# EAGLE schematic gd32 (EAGLE 9.6.2)

## Sheet 1 of 3
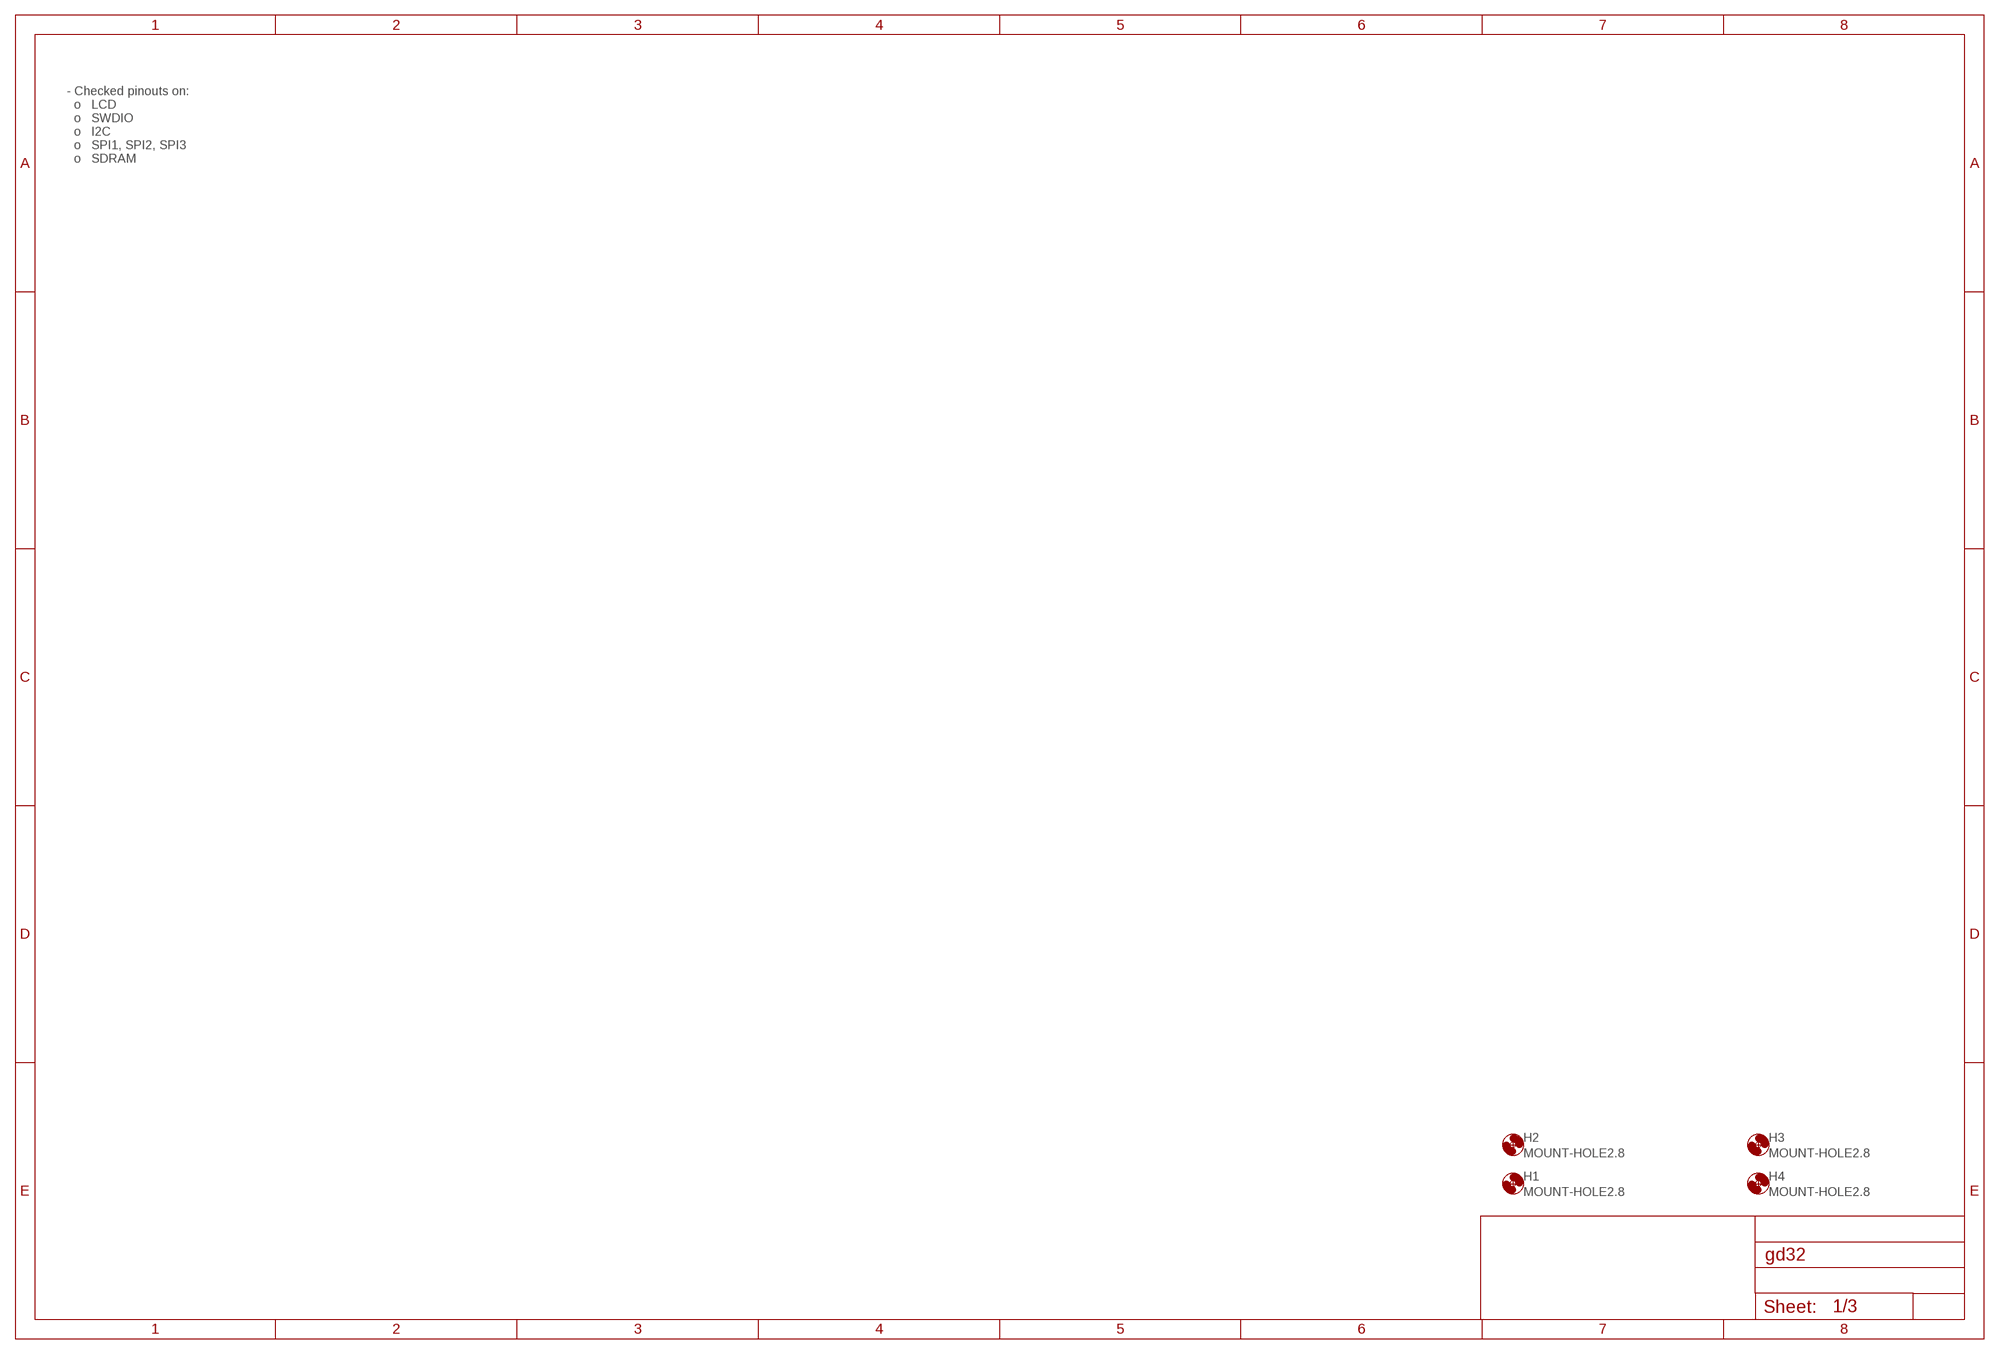
[diagram p0: schematic, sheet 1]

### Parts
H1  MOUNT-HOLE2.8  [2,8]
H2  MOUNT-HOLE2.8  [2,8]
H3  MOUNT-HOLE2.8  [2,8]
H4  MOUNT-HOLE2.8  [2,8]

### Notes on the sheet
- - Checked pinouts on:
    o   LCD
    o   SWDIO
    o   I2C
    o   SPI1, SPI2, SPI3
    o   SDRAM

## Sheet 2 of 3
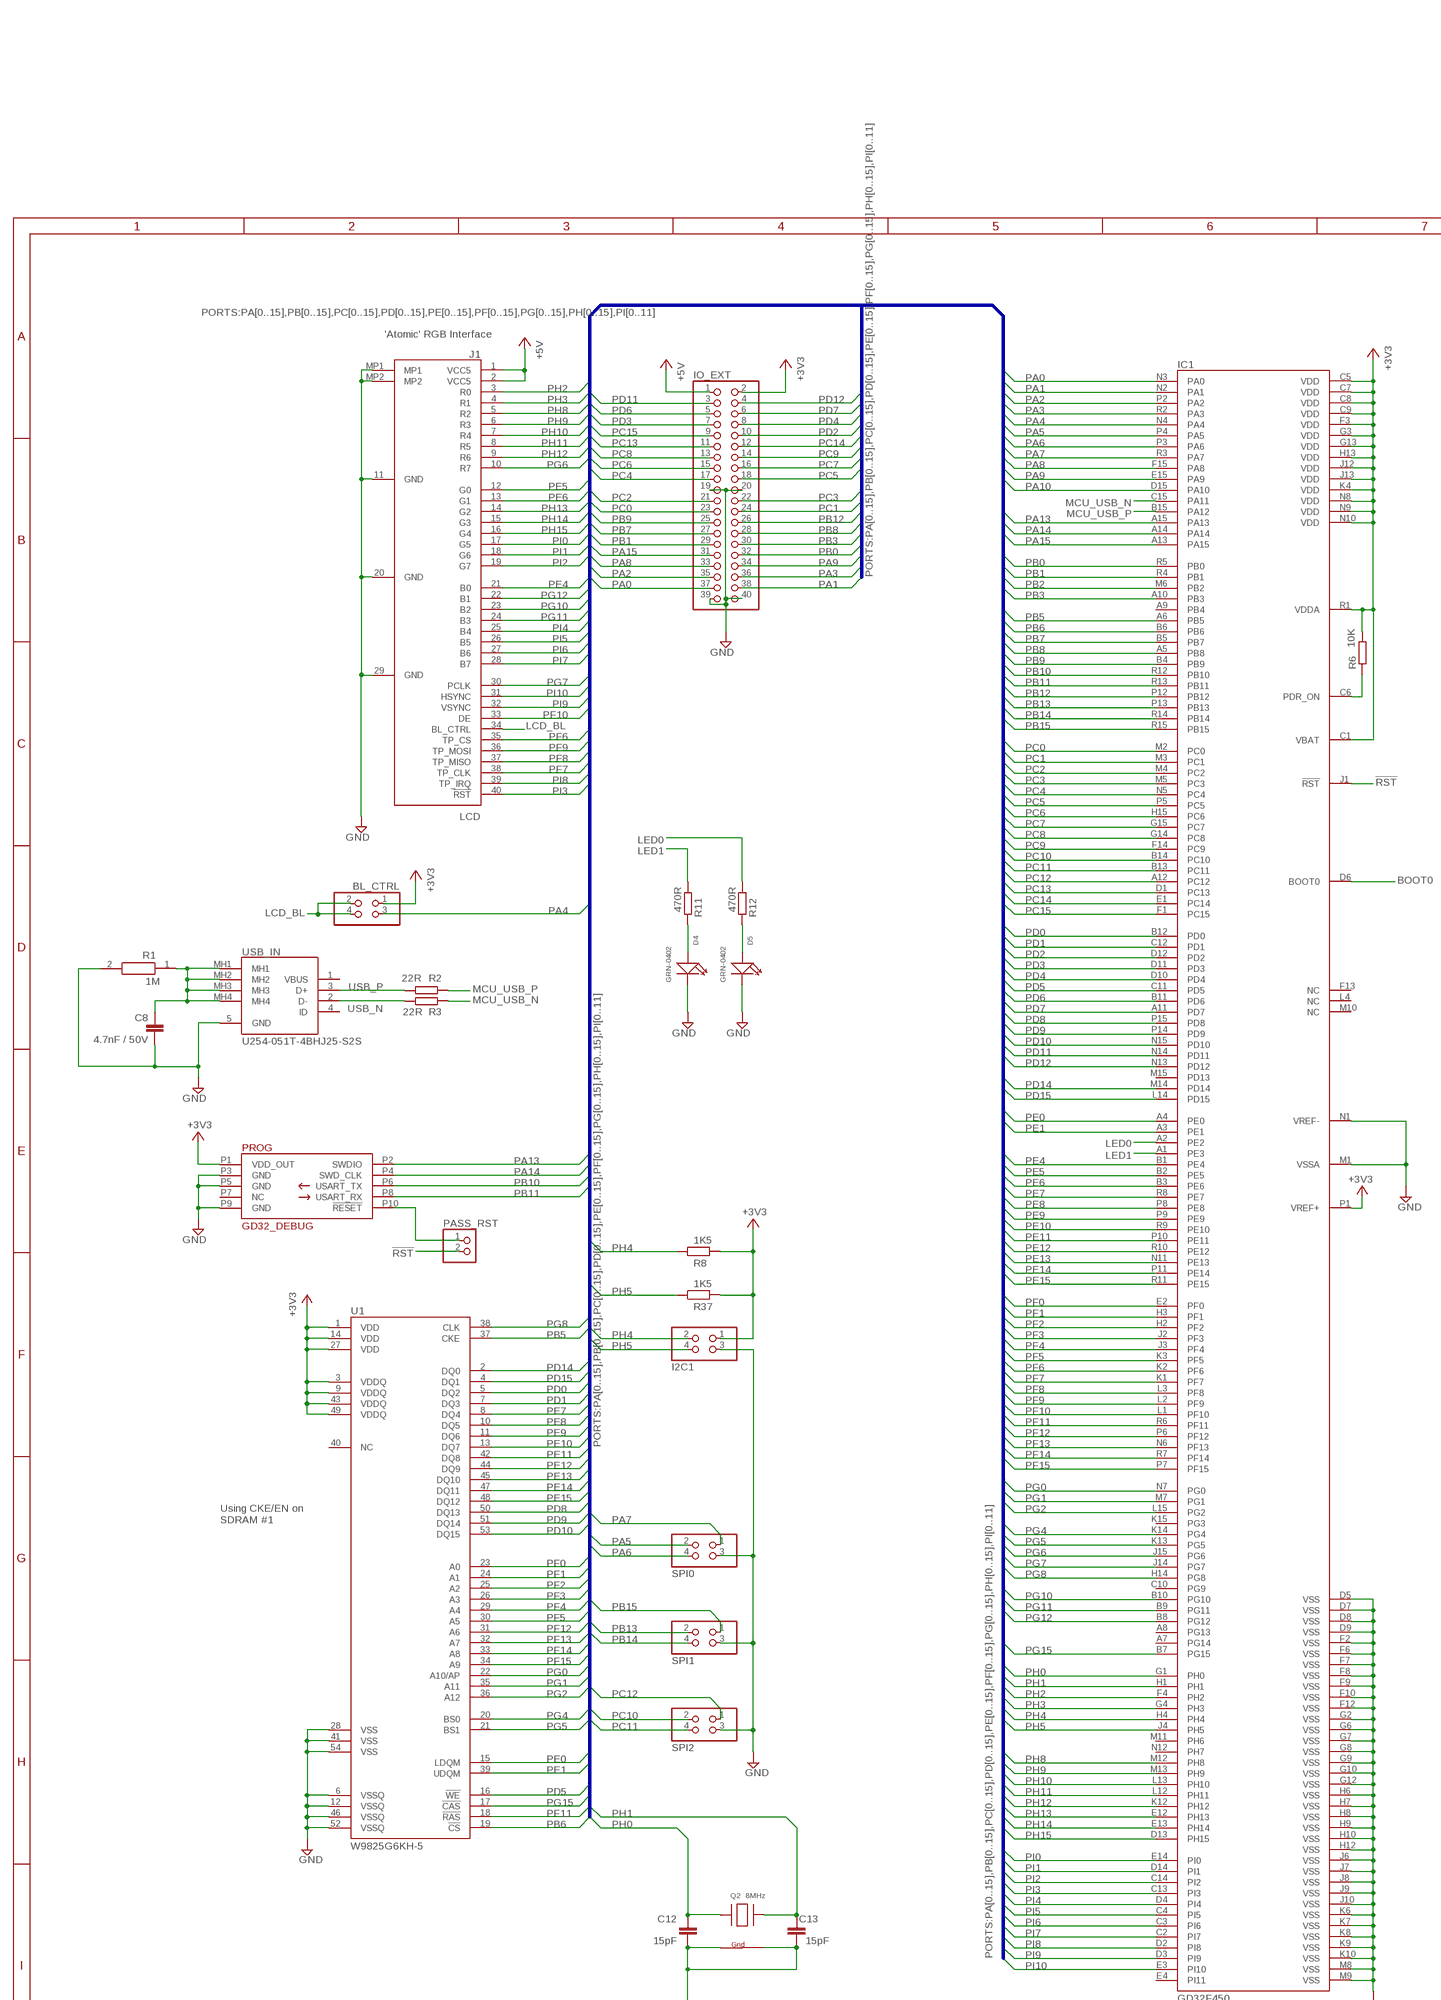
[diagram p1: schematic, sheet 2, part 1 of 3]
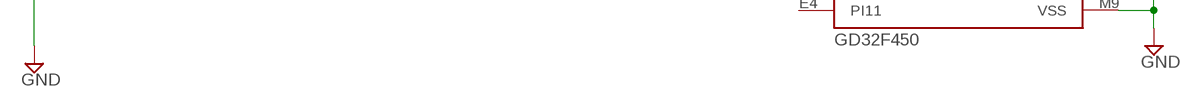
[diagram p2: schematic, sheet 2, part 2 of 3]
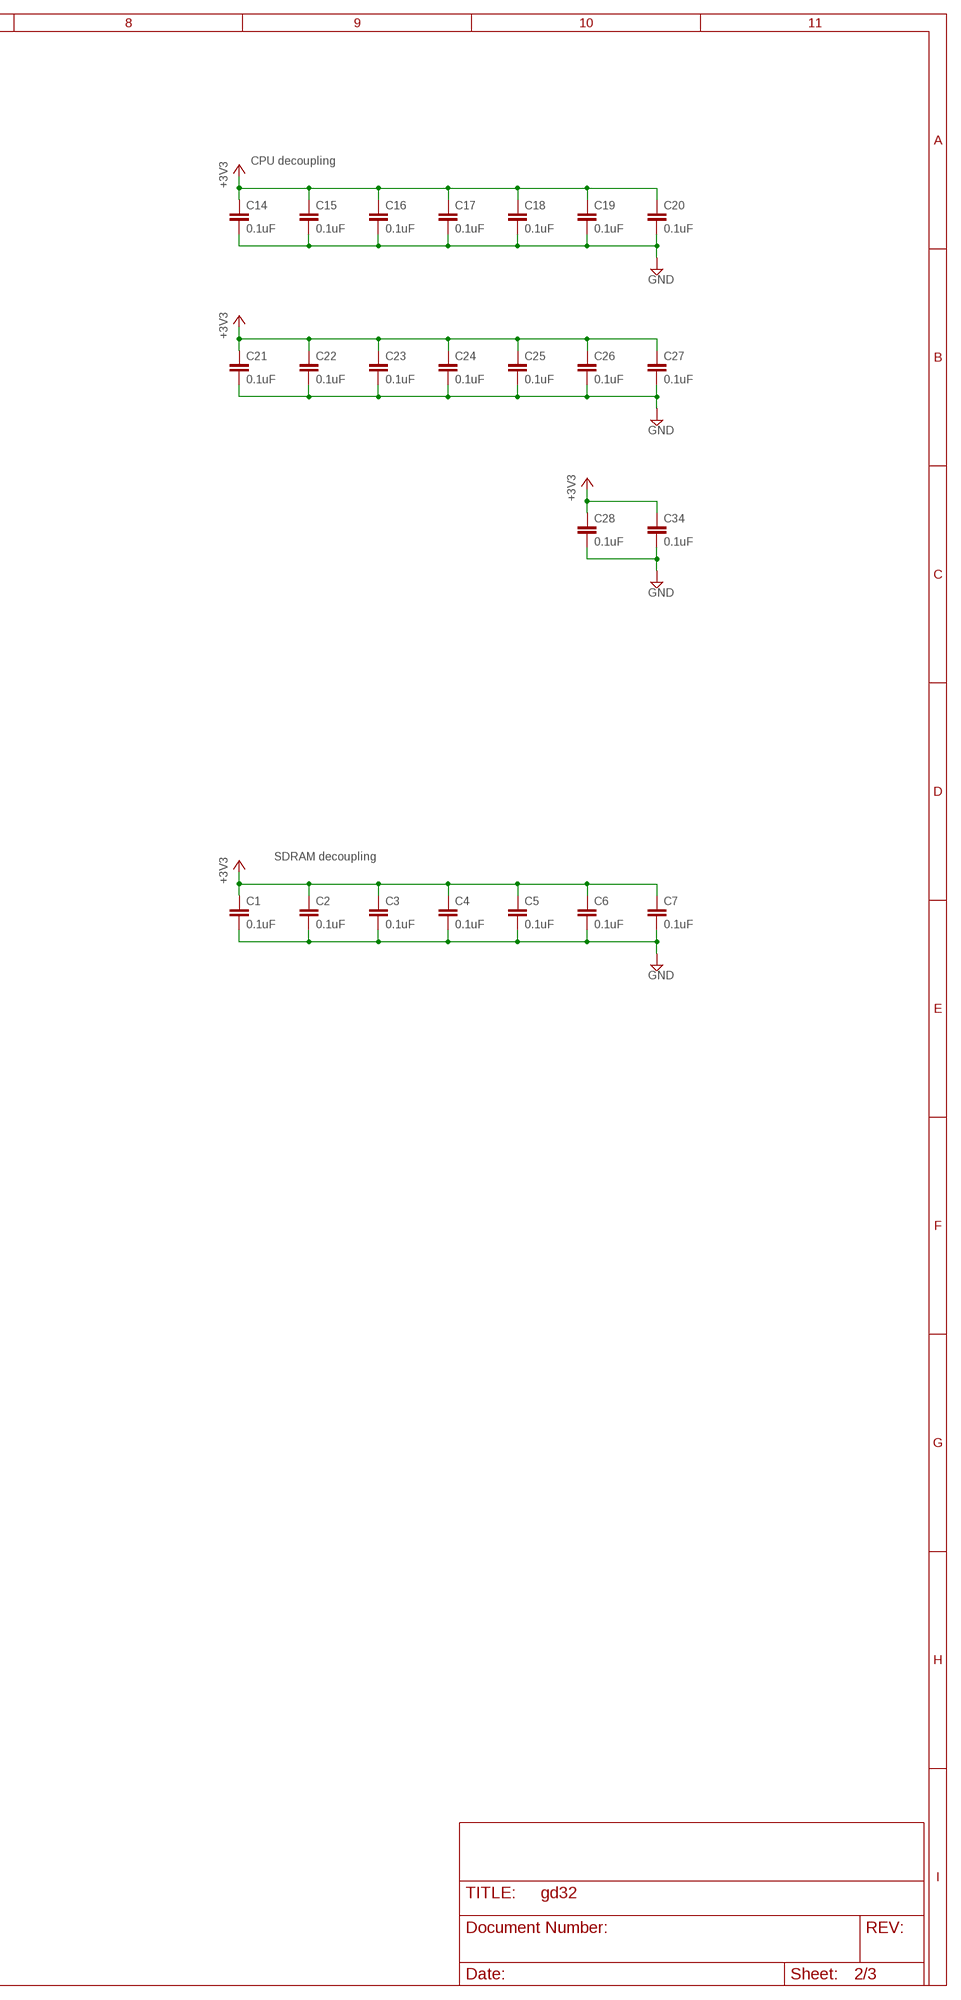
[diagram p3: schematic, sheet 2, part 3 of 3]

### Parts
BL_CTRL  PINHD-2X2  [2X02]
C1  0.1uF  C-EUC0201  [C0201]
C2  0.1uF  C-EUC0201  [C0201]
C3  0.1uF  C-EUC0201  [C0201]
C4  0.1uF  C-EUC0201  [C0201]
C5  0.1uF  C-EUC0201  [C0201]
C6  0.1uF  C-EUC0201  [C0201]
C7  0.1uF  C-EUC0201  [C0201]
C8  4.7nF / 50V  C-EUC0201  [C0201]
C12  15pF  C-EUC0201  [C0201]
C13  15pF  C-EUC0201  [C0201]
C14  0.1uF  C-EUC0201  [C0201]
C15  0.1uF  C-EUC0201  [C0201]
C16  0.1uF  C-EUC0201  [C0201]
C17  0.1uF  C-EUC0201  [C0201]
C18  0.1uF  C-EUC0201  [C0201]
C19  0.1uF  C-EUC0201  [C0201]
C20  0.1uF  C-EUC0201  [C0201]
C21  0.1uF  C-EUC0201  [C0201]
C22  0.1uF  C-EUC0201  [C0201]
C23  0.1uF  C-EUC0201  [C0201]
C24  0.1uF  C-EUC0201  [C0201]
C25  0.1uF  C-EUC0201  [C0201]
C26  0.1uF  C-EUC0201  [C0201]
C27  0.1uF  C-EUC0201  [C0201]
C28  0.1uF  C-EUC0201  [C0201]
C34  0.1uF  C-EUC0201  [C0201]
D4  GRN-0402  SMD-LED-CLEAR-BLUE(0402)  [LED-0402]
D5  GRN-0402  SMD-LED-CLEAR-BLUE(0402)  [LED-0402]
I2C1  PINHD-2X2  [2X02]
IC1  GD32F450  GD32F450II  [BGA201C65P15X15_1000X1000X84]
IO_EXT  PINHD-2X20  [2X20]
J1  LCD  CF5040FD0R0-05-NH  [CF5040FD0R005NH]
PASS_RST  PINHD-1X2  [1X02]
PROG  GD32_DEBUG  [SWD_DEBUG]
Q2  8MHz  XTAL-4-3225  [NX3225]
R1  1M  ERJ-1GNF1004C  [ERJ1GN_(0201)]
R2  22R  R-EU_R0402  [R0402]
R3  22R  R-EU_R0402  [R0402]
R6  10K  R-EU_R0402  [R0402]
R8  1K5  R-EU_R0603  [R0603]
R11  470R  R-EU_R0402  [R0402]
R12  470R  R-EU_R0402  [R0402]
R37  1K5  R-EU_R0603  [R0603]
SPI0  PINHD-2X2  [2X02]
SPI1  PINHD-2X2  [2X02]
SPI2  PINHD-2X2  [2X02]
U1  W9825G6KH-5  [SOP80P1176X120-54N]
USB_IN  U254-051T-4BHJ25-S2S  [U254051T4BHJ25S2S]

### Nets
!RST!: IC1.J1(!RST!) PASS_RST.2 ; also sheet 3
+3V3: BL_CTRL.1 C1.1 C2.1 C3.1 C4.1 C5.1 C6.1 C7.1 C14.1 C15.1 C16.1 C17.1 C18.1 C19.1 C20.1 C21.1 C22.1 C23.1 C24.1 C25.1 C26.1 C27.1 C28.1 C34.1 I2C1.1 IC1.C1(VBAT) IC1.C5(VDD) IC1.C7(VDD) IC1.C8(VDD) IC1.C9(VDD) IC1.F3(VDD) IC1.G3(VDD) IC1.G13(VDD) IC1.H13(VDD) IC1.J12(VDD) IC1.J13(VDD) IC1.K4(VDD) IC1.N8(VDD) IC1.N9(VDD) IC1.N10(VDD) IC1.P1(VREF+) IC1.R1(VDDA) IO_EXT.2 PROG.P1(VDD_OUT) R6.2 R8.2 R37.2 U1.1(VDD) U1.3(VDDQ) U1.9(VDDQ) U1.14(VDD) U1.27(VDD) U1.43(VDDQ) U1.49(VDDQ) ; also sheet 3
+5V: IO_EXT.1 J1.1(VCC5) J1.2(VCC5) ; also sheet 3
BOOT0: IC1.D6(BOOT0) ; also sheet 3
GND: C1.2 C2.2 C3.2 C4.2 C5.2 C6.2 C7.2 C8.2 C12.2 C13.2 C14.2 C15.2 C16.2 C17.2 C18.2 C19.2 C20.2 C21.2 C22.2 C23.2 C24.2 C25.2 C26.2 C27.2 C28.2 C34.2 D4.- D5.- I2C1.3 IC1.D5(VSS) IC1.D7(VSS) IC1.D8(VSS) IC1.D9(VSS) IC1.F2(VSS) IC1.F6(VSS) IC1.F7(VSS) IC1.F8(VSS) IC1.F9(VSS) IC1.F10(VSS) IC1.F12(VSS) IC1.G2(VSS) IC1.G6(VSS) IC1.G7(VSS) IC1.G8(VSS) IC1.G9(VSS) IC1.G10(VSS) IC1.G12(VSS) IC1.H6(VSS) IC1.H7(VSS) IC1.H8(VSS) IC1.H9(VSS) IC1.H10(VSS) IC1.H12(VSS) IC1.J6(VSS) IC1.J7(VSS) IC1.J8(VSS) IC1.J9(VSS) IC1.J10(VSS) IC1.K6(VSS) IC1.K7(VSS) IC1.K8(VSS) IC1.K9(VSS) IC1.K10(VSS) IC1.M1(VSSA) IC1.M8(VSS) IC1.M9(VSS) IC1.N1(VREF-) IO_EXT.19 IO_EXT.20 IO_EXT.39 IO_EXT.40 J1.11(GND) J1.20(GND) J1.29(GND) J1.MP1 J1.MP2 PROG.P3(GND) PROG.P5(GND) PROG.P9(GND) Q2.2(G2) Q2.4(G1) R1.2 SPI0.3 SPI1.3 SPI2.3 U1.6(VSSQ) U1.12(VSSQ) U1.28(VSS) U1.41(VSS) U1.46(VSSQ) U1.52(VSSQ) U1.54(VSS) USB_IN.5(GND) ; also sheet 3
LCD_BL: BL_CTRL.2 BL_CTRL.4 J1.34(BL_CTRL)
LED0: IC1.A2(PE2) R12.1
LED1: IC1.A1(PE3) R11.1
MCU_USB_N [USB]: IC1.C15(PA11) R3.1
MCU_USB_P [USB]: IC1.B15(PA12) R2.1
N$1: C8.1 R1.1 USB_IN.MH1 USB_IN.MH2 USB_IN.MH3 USB_IN.MH4
N$4: IC1.C6(PDR_ON) R6.1
N$5: PASS_RST.1 PROG.P10(!RESET!)
N$8: D4.+ R11.2
N$9: D5.+ R12.2
PA0: IC1.N3(PA0) IO_EXT.37
PA1: IC1.N2(PA1) IO_EXT.38
PA2: IC1.P2(PA2) IO_EXT.35
PA3: IC1.R2(PA3) IO_EXT.36
PA4: BL_CTRL.3 IC1.N4(PA4)
PA5: IC1.P4(PA5) SPI0.2
PA6: IC1.P3(PA6) SPI0.4
PA7: IC1.R3(PA7) SPI0.1
PA8: IC1.F15(PA8) IO_EXT.33
PA9: IC1.E15(PA9) IO_EXT.34
PA10: IC1.D15(PA10)
PA13: IC1.A15(PA13) PROG.P2(SWDIO)
PA14: IC1.A14 PROG.P4(SWD_CLK)
PA15: IC1.A13(PA15) IO_EXT.31
PB0: IC1.R5(PB0) IO_EXT.32
PB1: IC1.R4(PB1) IO_EXT.29
PB2: IC1.M6(PB2) ; also sheet 3
PB3: IC1.A10(PB3) IO_EXT.30
PB5: IC1.A6(PB5) U1.37(CKE)
PB6: IC1.B6 U1.19(!CS)
PB7: IC1.B5(PB7) IO_EXT.27
PB8: IC1.A5(PB8) IO_EXT.28
PB9: IC1.B4(PB9) IO_EXT.25
PB10: IC1.R12(PB10) PROG.P6(USART_TX)
PB11: IC1.R13(PB11) PROG.P8(USART_RX)
PB12: IC1.P12(PB12) IO_EXT.26
PB13: IC1.P13(PB13) SPI1.2
PB14: IC1.R14(PB14) SPI1.4
PB15: IC1.R15(PB15) SPI1.1
PC0: IC1.M2(PC0) IO_EXT.23
PC1: IC1.M3(PC1) IO_EXT.24
PC2: IC1.M4(PC2) IO_EXT.21
PC3: IC1.M5(PC3) IO_EXT.22
PC4: IC1.N5(PC4) IO_EXT.17
PC5: IC1.P5(PC5) IO_EXT.18
PC6: IC1.H15(PC6) IO_EXT.15
PC7: IC1.G15(PC7) IO_EXT.16
PC8: IC1.G14(PC8) IO_EXT.13
PC9: IC1.F14(PC9) IO_EXT.14
PC10: IC1.B14(PC10) SPI2.2
PC11: IC1.B13(PC11) SPI2.4
PC12: IC1.A12(PC12) SPI2.1
PC13: IC1.D1(PC13) IO_EXT.11
PC14: IC1.E1(PC14) IO_EXT.12
PC15: IC1.F1(PC15) IO_EXT.9
PD0: IC1.B12(PD0) U1.5(DQ2)
PD1: IC1.C12(PD1) U1.7(DQ3)
PD2: IC1.D12(PD2) IO_EXT.10
PD3: IC1.D11(PD3) IO_EXT.7
PD4: IC1.D10(PD4) IO_EXT.8
PD5: IC1.C11(PD5) U1.16(!WE)
PD6: IC1.B11(PD6) IO_EXT.5
PD7: IC1.A11(PD7) IO_EXT.6
PD8: IC1.P15(PD8) U1.50(DQ13)
PD9: IC1.P14(PD9) U1.51(DQ14)
PD10: IC1.N15(PD10) U1.53(DQ15)
PD11: IC1.N14(PD11) IO_EXT.3
PD12: IC1.N13(PD12) IO_EXT.4
PD14: IC1.M14(PD14) U1.2(DQ0)
PD15: IC1.L14(PD15) U1.4(DQ1)
PE0: IC1.A4(PE0) U1.15(LDQM)
PE1: IC1.A3(PE1) U1.39(UDQM)
PE4: IC1.B1(PE4) J1.21(B0)
PE5: IC1.B2(PE5) J1.12(G0)
PE6: IC1.B3(PE6) J1.13(G1)
PE7: IC1.R8(PE7) U1.8(DQ4)
PE8: IC1.P8(PE8) U1.10(DQ5)
PE9: IC1.P9(PE9) U1.11(DQ6)
PE10: IC1.R9(PE10) U1.13(DQ7)
PE11: IC1.P10(PE11) U1.42(DQ8)
PE12: IC1.R10(PE12) U1.44(DQ9)
PE13: IC1.N11(PE13) U1.45(DQ10)
PE14: IC1.P11(PE14) U1.47(DQ11)
PE15: IC1.R11(PE15) U1.48(DQ12)
PF0: IC1.E2(PF0) U1.23(A0)
PF1: IC1.H3(PF1) U1.24(A1)
PF2: IC1.H2(PF2) U1.25(A2)
PF3: IC1.J2(PF3) U1.26(A3)
PF4: IC1.J3(PF4) U1.29(A4)
PF5: IC1.K3(PF5) U1.30(A5)
PF6: IC1.K2(PF6) J1.35(TP_CS)
PF7: IC1.K1(PF7) J1.38(TP_CLK)
PF8: IC1.L3(PF8) J1.37(TP_MISO)
PF9: IC1.L2(PF9) J1.36(TP_MOSI)
PF10: IC1.L1(PF10) J1.33(DE)
PF11: IC1.R6(PF11) U1.18(!RAS)
PF12: IC1.P6(PF12) U1.31(A6)
PF13: IC1.N6(PF13) U1.32(A7)
PF14: IC1.R7(PF14) U1.33(A8)
PF15: IC1.P7(PF15) U1.34(A9)
PG0: IC1.N7(PG0) U1.22(A10/AP)
PG1: IC1.M7(PG1) U1.35(A11)
PG2: IC1.L15(PG2) U1.36(A12)
PG4: IC1.K14(PG4) U1.20(BS0)
PG5: IC1.K13(PG5) U1.21(BS1)
PG6: IC1.J15(PG6) J1.10(R7)
PG7: IC1.J14(PG7) J1.30(PCLK)
PG8: IC1.H14(PG8) U1.38(CLK)
PG10: IC1.B10(PG10) J1.23(B2)
PG11: IC1.B9(PG11) J1.24(B3)
PG12: IC1.B8(PG12) J1.22(B1)
PG15: IC1.B7(PG15) U1.17(!CAS)
PH0: C12.1 IC1.G1(PH0) Q2.1(X1)
PH1: C13.1 IC1.H1 Q2.3(X2)
PH2: IC1.F4(PH2) J1.3(R0)
PH3: IC1.G4(PH3) J1.4(R1)
PH4: I2C1.2 IC1.H4 R8.1
PH5: I2C1.4 IC1.J4(PH5) R37.1
PH8: IC1.M12(PH8) J1.5(R2)
PH9: IC1.M13(PH9) J1.6(R3)
PH10: IC1.L13(PH10) J1.7(R4)
PH11: IC1.L12(PH11) J1.8(R5)
PH12: IC1.K12(PH12) J1.9(R6)
PH13: IC1.E12(PH13) J1.14(G2)
PH14: IC1.E13(PH14) J1.15(G3)
PH15: IC1.D13(PH15) J1.16(G4)
PI0: IC1.E14(PI0) J1.17(G5)
PI1: IC1.D14(PI1) J1.18(G6)
PI2: IC1.C14(PI2) J1.19(G7)
PI3: IC1.C13(PI3) J1.40(!RST!)
PI4: IC1.D4(PI4) J1.25(B4)
PI5: IC1.C4(PI5) J1.26(B5)
PI6: IC1.C3(PI6) J1.27(B6)
PI7: IC1.C2(PI7) J1.28(B7)
PI8: IC1.D2(PI8) J1.39(TP_IRQ)
PI9: IC1.D3(PI9) J1.32(VSYNC)
PI10: IC1.E3(PI10) J1.31(HSYNC)
USB_N [USB]: R3.2 USB_IN.2(D-)
USB_P [USB]: R2.2 USB_IN.3(D+)
Unconnected: IC1.A7(PG14) IC1.A8(PG13) IC1.A9(PB4) IC1.C10(PG9) IC1.E4(PI11) IC1.F13(NC) IC1.K15(PG3) IC1.L4(NC) IC1.M10(NC) IC1.M11(PH6) IC1.M15(PD13) IC1.N12(PH7) PROG.P7(NC) U1.40(NC) USB_IN.1(VBUS) USB_IN.4(ID)

### Buses
PORTS:PA[0..15],PB[0..15],PC[0..15],PD[0..15],PE[0..15],PF[0..15],PG[0..15],PH[0..15],PI[0..11]

### Notes on the sheet
- 'Atomic' RGB Interface
- CPU decoupling
- SDRAM decoupling
- Using CKE/EN on
  SDRAM #1

## Sheet 3 of 3
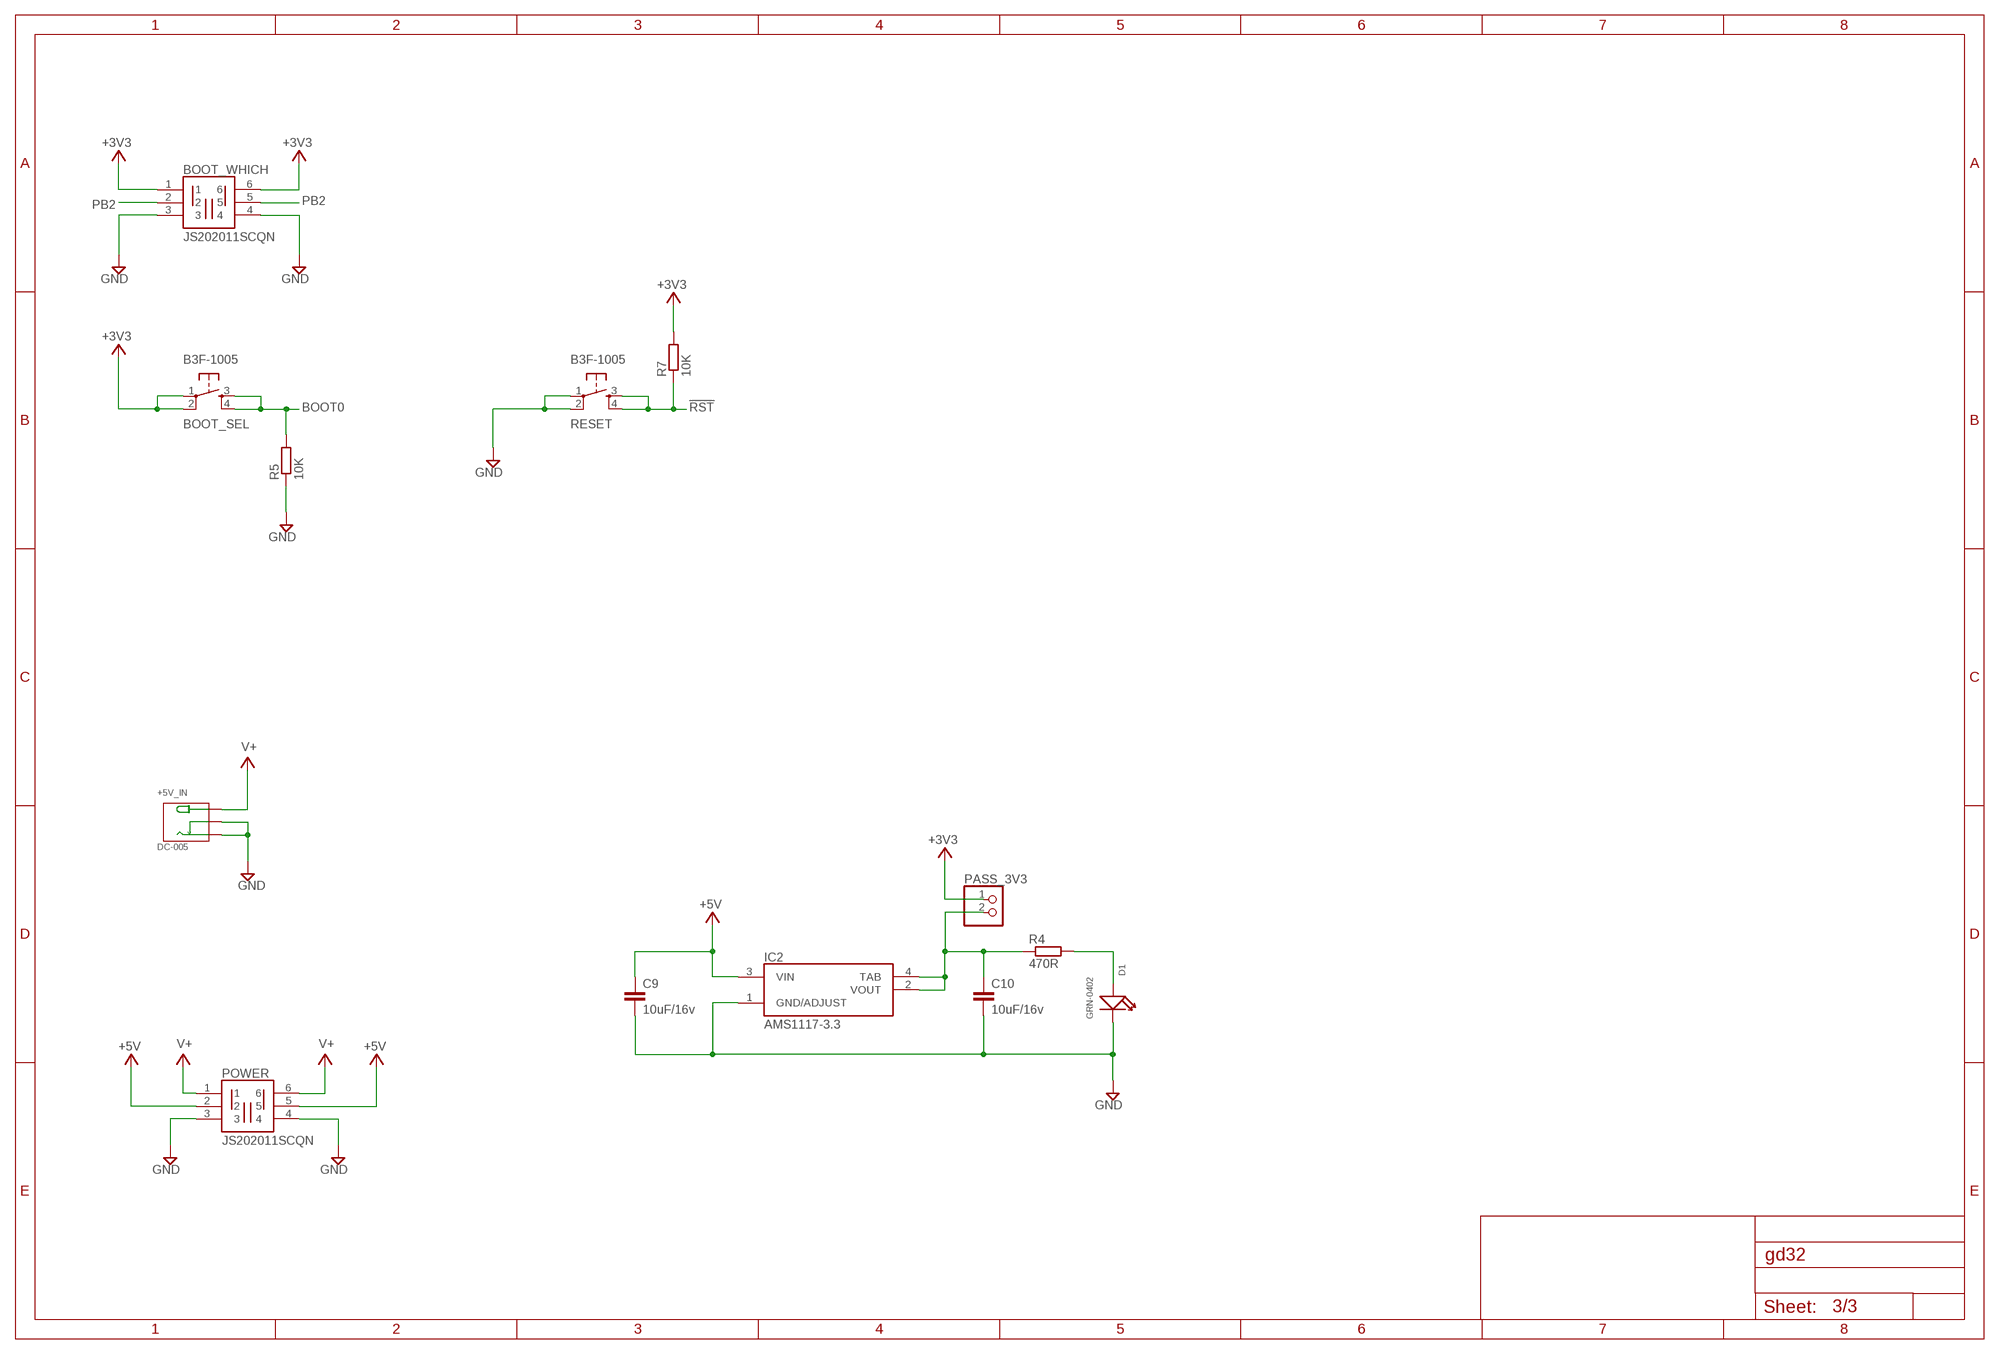
[diagram p4: schematic, sheet 3]

### Parts
+5V_IN  DC-005  CONN-POWER-JACK-2.1MM(DC-005)  [DCJ3P-14.2X11.0X9.0MM]
BOOT_SEL  B3F-1005  TAC_SWITCHPTH  [TACTILE-PTH]
BOOT_WHICH  JS202011SCQN  [JS202011SCQN]
C9  10uF/16v  C-EUC0603  [C0603]
C10  10uF/16v  C-EUC0603  [C0603]
D1  GRN-0402  SMD-LED-CLEAR-BLUE(0402)  [LED-0402]
IC2  AMS1117-3.3  AMS1117-1.5  [SOT229P700X180-4N]
PASS_3V3  PINHD-1X2  [1X02]
POWER  JS202011SCQN  [JS202011SCQN]
R4  470R  R-EU_R0402  [R0402]
R5  10K  R-EU_R0402  [R0402]
R7  10K  R-EU_R0402  [R0402]
RESET  B3F-1005  TAC_SWITCHPTH  [TACTILE-PTH]

### Nets
!RST!: R7.1 RESET.3 RESET.4 ; also sheet 2
+3V3: BOOT_SEL.1 BOOT_SEL.2 BOOT_WHICH.1 BOOT_WHICH.6 PASS_3V3.1 R7.2 ; also sheet 2
+5V: C9.1 IC2.3(VIN) POWER.2 POWER.5 ; also sheet 2
BOOT0: BOOT_SEL.3 BOOT_SEL.4 R5.2 ; also sheet 2
GND: +5V_IN.-1(-) +5V_IN.-2(CDN) BOOT_WHICH.3 BOOT_WHICH.4 C9.2 C10.2 D1.- IC2.1(GND/ADJUST) POWER.3 POWER.4 R5.1 RESET.1 RESET.2 ; also sheet 2
N$2: D1.+ R4.2
N$3: C10.1 IC2.2(VOUT) IC2.4(TAB) PASS_3V3.2 R4.1
PB2: BOOT_WHICH.2 BOOT_WHICH.5 ; also sheet 2
V+: +5V_IN.+ POWER.1 POWER.6

## Library data of the parts
+5V_IN = sjg-power:CONN-POWER-JACK-2.1MM(DC-005): 320120003; MPN: DC-005; USE: PJ-102AH
BL_CTRL I2C1 SPI0 SPI1 SPI2 = pinhead:PINHD-2X2: PIN HEADER
BOOT_SEL RESET = SparkFun:TAC_SWITCH: Momentary Switch Button commonly used for reset or general input. Spark Fun Electronics SKU : COM-00097; USE: B3F-1005
BOOT_WHICH POWER = samacsys:JS202011SCQN: Sub miniature slide switches Source: Datasheet <http://www.ckswitches.com/media/1422/js.pdf>; ARROW_PART_NUMBER: JS202011SCQN; ARROW_PRICE-STOCK: https://www.arrow.com/en/products/js202011scqn/ck?region=nac; DESCRIPTION: Sub miniature slide switches; HEIGHT: 5.5mm; MANUFACTURER_NAME: C & K COMPONENTS; MANUFACTURER_PART_NUMBER: JS202011SCQN; MOUSER_PART_NUMBER: 611-JS202011SCQN; MOUSER_PRICE-STOCK: https://www.mouser.co.uk/ProductDetail/CK/JS202011SCQN?qs=LgMIjt8LuD95JYWxZ7NvZA%3D%3D; USE: JS202011SCQN
C1-C7 C14-C28 C34 = rcl:C-EU: CAPACITOR, European symbol; SPICEPREFIX: C; USE: GRM033R61A104ME15D
C8 = rcl:C-EU: CAPACITOR, European symbol; SPICEPREFIX: C; USE: UMK063BJ472MP-F
C9 C10 = rcl:C-EU: CAPACITOR, European symbol; SPICEPREFIX: C; USE: GRM188R61C106MA73D
C12 C13 = rcl:C-EU: CAPACITOR, European symbol; SPICEPREFIX: C; USE: 0201N150J500CT
D1 D4 D5 = Seeed-LED:SMD-LED-CLEAR-BLUE(0402): 304090075; MPN: BL-HB337A-AV-TRB; USE: IN-S42BT5G; VALUE: BLUE-0402
H1-H4 = holes:MOUNT-HOLE: MOUNTING HOLE with drill center marker
IC1 = gd32:GD32F450II: ARM Microcontrollers - MCU ARM CORTEX M4 MCU, BGA176, Tra Source: Datasheet <http://www.gd32mcu.com/data/documents/shujushouce/GD32F450xx_Datasheet_Rev1.1.pdf>; DESCRIPTION: ARM Microcontrollers - MCU ARM CORTEX M4 MCU, BGA176, Tra; HEIGHT: 0.84mm; MANUFACTURER_NAME: GigaDevice; MANUFACTURER_PART_NUMBER: GD32F450IKH6; MOUSER_PART_NUMBER: N/A; MOUSER_PRICE-STOCK: https://www.mouser.co.uk/ProductDetail/GigaDevice/GD32F450IKH6?qs=TiOZkKH1s2S3HGhYMkdG9Q%3D%3D
IC2 = samacsys:AMS1117-1.5: 1A LOW DROPOUT VOLTAGE REGULATOR Source: Datasheet <http://www.advanced-monolithic.com/pdf/ds1117.pdf>; DESCRIPTION: 1A LOW DROPOUT VOLTAGE REGULATOR; HEIGHT: 1.8mm; MANUFACTURER_NAME: ams; MANUFACTURER_PART_NUMBER: AMS1117-1.5; USE: ams1117-3.3
IO_EXT = pinhead:PINHD-2X20: PIN HEADER
J1 = samacsys:CF5040FD0R0-05-NH: ZIF FFC/FCP connector Source: Datasheet <https://www.cvilux.com/uploads/drawings/101/191/CF5002S.pdf>; DESCRIPTION: ZIF FFC/FCP connector; HEIGHT: 1.56mm; MANUFACTURER_NAME: CROUSE-HINDS; MANUFACTURER_PART_NUMBER: CF5040FD0R0-05-NH; USE: CF5040FD0R0-05-NH
PASS_3V3 PASS_RST = pinhead:PINHD-1X2: PIN HEADER
PROG = sjg-stm32:GD32_DEBUG; USE: FTSH-105-01-LM-DV-K-P-TR
Q2 = adafruit:XTAL-4: Classic 4-pin 3.2 x 2.5mm crystal; USE: E3SB8E0000003E
R1 = samacsys:ERJ-1GNF1004C: Res Thick Film 0201 1M Ohm 1% 0.05W(1/20W) +/-200ppm/C Pad SMD Automotive T/R Source: Datasheet <https://industrial.panasonic.com/cdbs/www-data/pdf/RDA0000/AOA0000C301.pdf>; ARROW_PART_NUMBER: ERJ-1GNF1004C; ARROW_PRICE-STOCK: https://www.arrow.com/en/products/erj-1gnf1004c/panasonic?region=nac; DESCRIPTION: Res Thick Film 0201 1M Ohm 1% 0.05W(1/20W) +/-200ppm/C Pad SMD Automotive T/R; HEIGHT: 0.26mm; MANUFACTURER_NAME: Panasonic; MANUFACTURER_PART_NUMBER: ERJ-1GNF1004C; MOUSER_PART_NUMBER: 667-ERJ-1GNF1004C; MOUSER_PRICE-STOCK: https://www.mouser.co.uk/ProductDetail/Panasonic/ERJ-1GNF1004C?qs=nuXzIS8loXFKlAzFIo79DA%3D%3D; USE: ERJ-1GNF1004C
R2 R3 = rcl:R-EU_: RESISTOR, European symbol; SPICEPREFIX: R; USE: CR0402-JW-220GLF
R4 R11 R12 = rcl:R-EU_: RESISTOR, European symbol; SPICEPREFIX: R; USE: CR0402-FX-4700GLF
R5-R7 = rcl:R-EU_: RESISTOR, European symbol; SPICEPREFIX: R; USE: CR0402-JW-103GLF
R8 R37 = rcl:R-EU_: RESISTOR, European symbol; SPICEPREFIX: R; USE: WR06X152 JTL
U1 = samacsys:W9825G6KH-5: DRAM 256M SDR SDRAM x16, 166MHz Source: Datasheet <http://www.winbond.com/resource-files/w9825g6kh_a04.pdf>; ARROW_PART_NUMBER: W9825G6KH-5; ARROW_PRICE-STOCK: https://www.arrow.com/en/products/w9825g6kh-5/winbond-electronics?region=nac; DESCRIPTION: DRAM 256M SDR SDRAM x16, 166MHz; HEIGHT: 1.2mm; MANUFACTURER_NAME: Winbond; MANUFACTURER_PART_NUMBER: W9825G6KH-5; MOUSER_PART_NUMBER: 454-W9825G6KH-5; MOUSER_PRICE-STOCK: https://www.mouser.co.uk/ProductDetail/Winbond/W9825G6KH-5?qs=qSfuJ%252Bfl%2Fd5GA9vAeXgu7w%3D%3D; USE: W9825G6KH-5
USB_IN = samacsys:U254-051T-4BHJ25-S2S: USB Connectors SMD RoHS Source: Datasheet <http://www.helloxkb.com/public/images/pdf/U254-051T-4BHJ25-S2S-.pdf>; DESCRIPTION: USB Connectors SMD RoHS; HEIGHT: 2.9mm; MANUFACTURER_NAME: XKB Connectivity; MANUFACTURER_PART_NUMBER: U254-051T-4BHJ25-S2S; USE: U254-051T-4BHJ25-S2S

## Net classes
0 default: width 0.089 mm
1 USB: width 0.33 mm, clearance 0.102 mm to class 0, clearance 0.254 mm